# EAGLE design bebox_encoder (EAGLE 9.3.1)
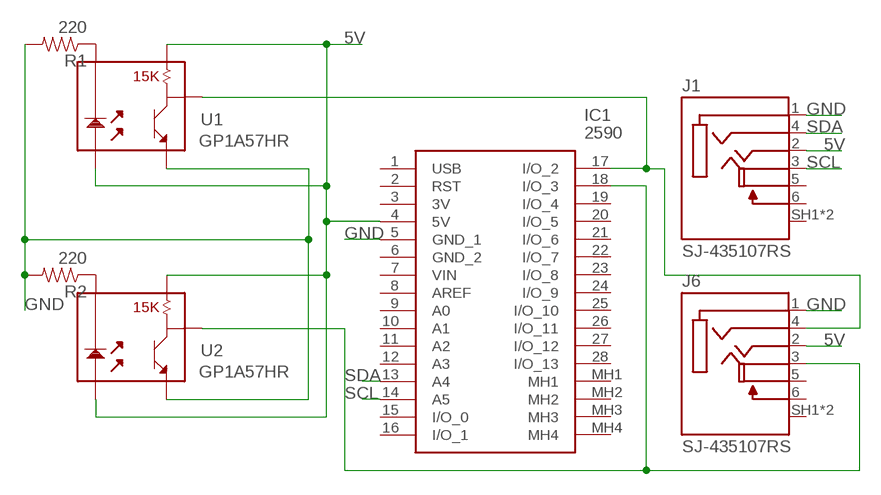
[diagram p0: schematic, sheet 1]

## Parts
IC1  2590  [2590]
J1  SJ-435107RS  [CUI_SJ-435107RS]
J6  SJ-435107RS  [CUI_SJ-435107RS]
R1  220  RESISTORPTH1  [AXIAL-0.3]
R2  220  RESISTORPTH1  [AXIAL-0.3]
U1  GP1A57HR  [GP1A57HR]
U2  GP1A57HR  [GP1A57HR]

## Nets
5V: IC1.4(5V) J1.2(TIP) J6.2(TIP) U1.1 U1.3 U2.1 U2.3
GND: IC1.5(GND_1) J1.1(SLEEVE) J6.1(SLEEVE) R1.P$2 R2.P$2 U1.5 U2.5
N$2: R2.P$1 U2.2
N$4: R1.P$1 U1.2
N$5: IC1.17(I/O_2) J6.4(RING2) U1.4
N$6: IC1.18(I/O_3) J6.3(RING1) U2.4
SCL: IC1.14(A5) J1.3(RING1)
SDA: IC1.13(A4) J1.4(RING2)
Unconnected: IC1.1(USB) IC1.2(RST) IC1.3(3V) IC1.6(GND_2) IC1.7(VIN) IC1.8(AREF) IC1.9(A0) IC1.10(A1) IC1.11(A2) IC1.12(A3) IC1.15(I/O_0) IC1.16(I/O_1) IC1.19(I/O_4) IC1.20(I/O_5) IC1.21(I/O_6) IC1.22(I/O_7) IC1.23(I/O_8) IC1.24(I/O_9) IC1.25(I/O_10) IC1.26(I/O_11) IC1.27(I/O_12) IC1.28(I/O_13) IC1.MH1 IC1.MH2 IC1.MH3 IC1.MH4 J1.5(ISOLATED_RING1) J1.6(ISOLATED_RING1_SWITCH(N-O)) J1.SH1(SHIELD) J1.SH2(SHIELD) J6.5(ISOLATED_RING1) J6.6(ISOLATED_RING1_SWITCH(N-O)) J6.SH1(SHIELD) J6.SH2(SHIELD)

## Library data of the parts
IC1 = 2590:2590: Development Boards & Kits - AVR Adafruit Metro Mini 328 - 5V 16MHz Source: Datasheet <https://www.adafruit.com/product/2590>; ALLIED_NUMBER: 70929194; ALLIED_PRICE-STOCK: https://www.alliedelec.com/adafruit-industries-2590/70929194/; DESCRIPTION: Development Boards & Kits - AVR Adafruit Metro Mini 328 - 5V 16MHz; HEIGHT: 4mm; MANUFACTURER_NAME: Adafruit; MANUFACTURER_PART_NUMBER: 2590; MOUSER_PART_NUMBER: 485-2590; MOUSER_PRICE-STOCK: https://www.mouser.com/Search/Refine.aspx?Keyword=485-2590; RS_PART_NUMBER: 1245512; RS_PRICE-STOCK: http://uk.rs-online.com/web/p/products/1245512
J1 J6 = SJ-435107RS:SJ-435107RS: 3.5 mm Right Angle Shielded (0.141", 1/8", Mini Plug) Female HeadPhone Jack; AVAILABILITY: Good; DESCRIPTION: 3.5 mm Right Angle Shielded _0.141, 1/8, Mini Plug_ Female HeadPhone Jack; MF: CUI; MP: SJ-435107RS; PACKAGE: None; PRICE: 1.04 USD
R1 R2 = SparkFun:RESISTOR: Resistor Basic schematic elements and footprints for 0603, 1206, and PTH 1/10th watt (small) resistors.
U1 U2 = SparkFun:GP1A57HR

## Board
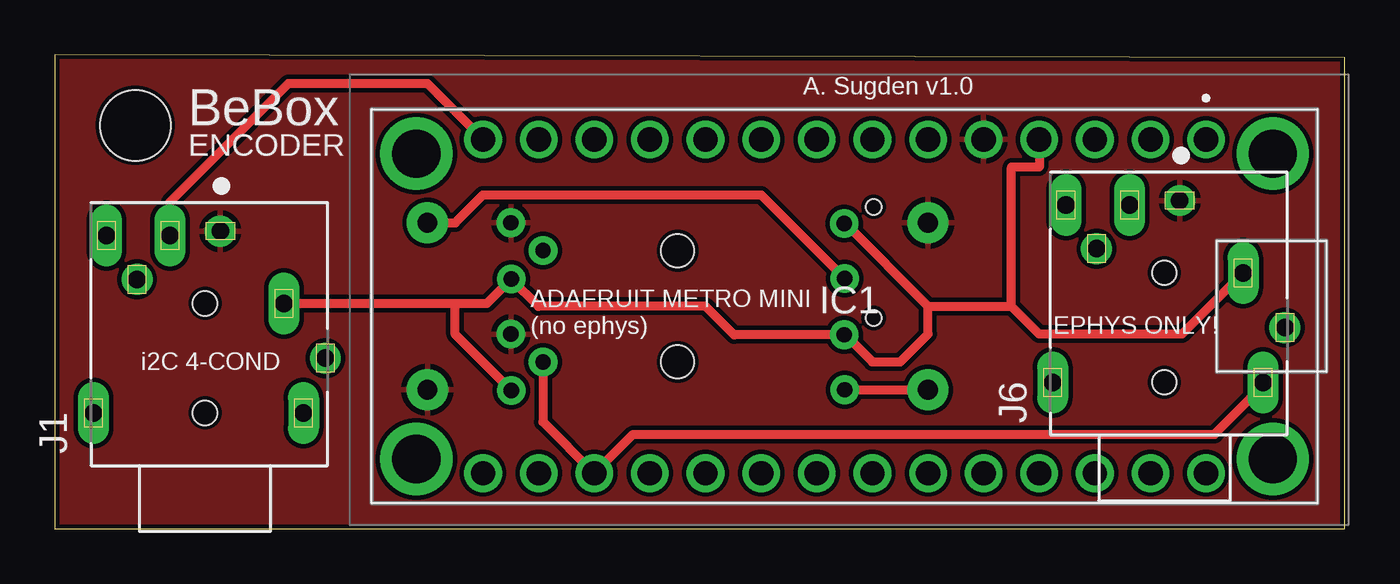
[diagram p1: board, top side]
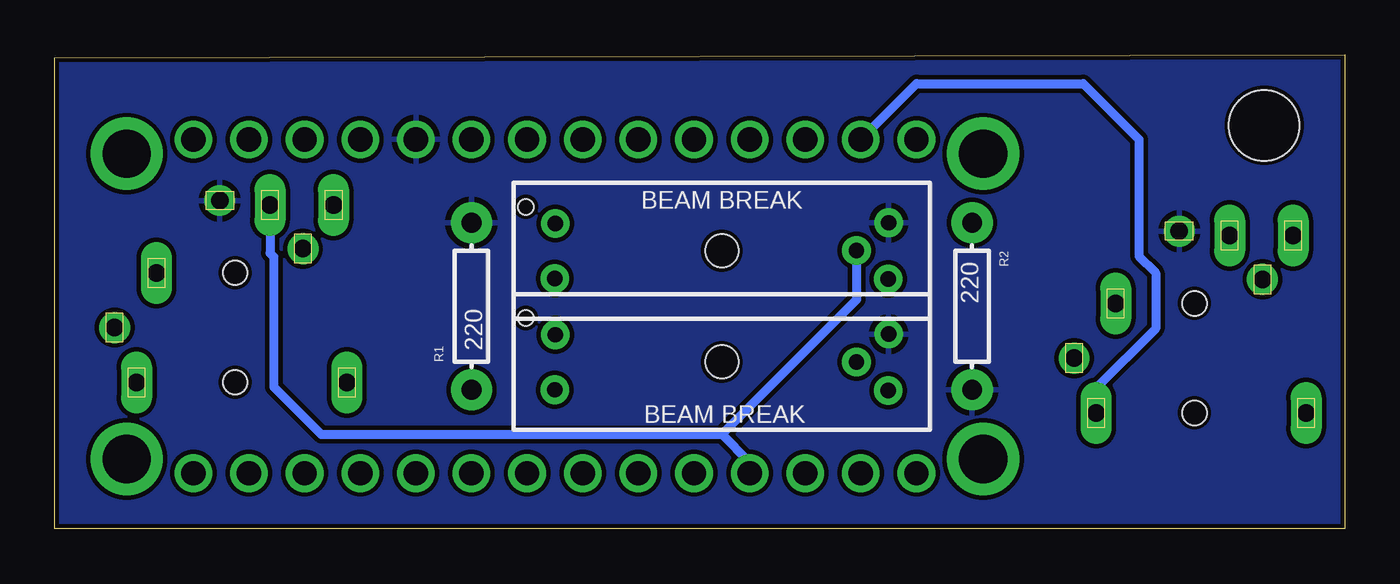
[diagram p2: board, bottom side, seen from below]

Size 58.91 x 21.64 mm. Coordinates in mm from the lower left corner, seen from the top.
Outline: 0,0 58.91,0 58.91,21.51 0,21.64 0,0
Copper layers (1*16): Top 0.035mm / dielectric 1.5mm / Bottom 0.035mm
Design rules "SparkFun": minimum track width 8mil, minimum drill 20mil, track to track 8mil, track to pad 8mil, pad to pad 8mil, via to via 8mil, smd to smd 8mil, copper to edge 8mil, drill to drill 8mil, minimum pad ring 12mil, minimum via ring 10mil, stop-mask expansion 4mil, vias tented up to drill 20mil, thermal gap 10mil
Holes 3.2 mm at 3.68,18.41

### Footprints (pad centres in the part's own frame; a part is rotated, then mirrored left to right if it is on the bottom)
2590 = drill 1.11 pad 1.665: 1 -16.51,-7.62; 2 -13.97,-7.62; 3 -11.43,-7.62; 4 -8.89,-7.62; 5 -6.35,-7.62; 6 -3.81,-7.62; 7 -1.27,-7.62; 8 1.27,-7.62; 9 3.81,-7.62; 10 6.35,-7.62; 11 8.89,-7.62; 12 11.43,-7.62; 13 13.97,-7.62; 14 16.51,-7.62; 15 16.51,7.62; 16 13.97,7.62; 17 11.43,7.62; 18 8.89,7.62; 19 6.35,7.62; 20 3.81,7.62; 21 1.27,7.62; 22 -1.27,7.62; 23 -3.81,7.62; 24 -6.35,7.62; 25 -8.89,7.62; 26 -11.43,7.62; 27 -13.97,7.62; 28 -16.51,7.62 | drill 2.2 pad 3.3: MH1 -19.558,6.968; MH2 -19.558,-6.968; MH3 19.558,-6.968; MH4 19.558,6.968
CUI_SJ-435107RS = drill 0.8 pad 1.1: 1 4.7,-0.7; 5 2.5,3.1; SH2 -1.1,-5.5 | drill 0.8 pad 1.1 long: 2 1.4,-3.6; 3 4.5,1.6; 4 -3.6,-4.5; 6 4.5,4.5; SH1 -3.6,5.1 | hole 1.1: -3.6,0; 1.4,0
AXIAL-0.3 = drill 0.9 pad 1.88: P$1 -3.81,0; P$2 3.81,0
GP1A57HR = drill 0.7: 1 -7.6,1.24; 2 -7.62,-1.27; 3 7.6,-1.3; 4 6.15,0; 5 7.62,1.27 | hole 1.5: 0,0 | hole 0.7: -8.95,2

### Placement (x,y rotation side)
IC1  36.07,10.16 180 top
J1  6.86,8.89 90 top
J6  50.67,10.29 90 top
R1  39.88,10.16 90 bottom
R2  17.02,10.16 270 bottom
U1  28.45,7.62 0 bottom
U2  28.45,12.7 0 bottom

### Tracks (layer width: path | path; a pad name or v marks a point on that pad's centre or on a via)
5V
  Top 0.406: IC1.4 44.96,16.51 43.69,16.51 43.69,10.16 | J6.2 51.48,8.89 44.96,8.89 43.69,10.16 | J1.2 18.29,10.29 | 18.29,10.29 19.74,10.29 U2.3 22.09,10.16 29.72,10.16 31.02,8.86 U1.1 36.1,8.86 37.34,7.62 38.61,7.62 39.88,8.89 39.88,10.16 | U1.3 18.29,8.88 18.29,10.29 | 39.88,10.16 43.69,10.16 | U2.1 36.1,13.94 39.88,10.16
GND
  pour Top: -0.76,21.59 -0.76,0 58.93,0 58.93,21.59
  pour Bottom: -0.76,21.59 -0.76,0 58.93,0 58.93,21.59
N$2
  Top 0.406: R2.P$1 18.29,13.97 19.56,15.24 32.26,15.24 U2.2
N$4
  Top 0.406: U1.2 R1.P$1
N$5
  Top 0.406: U1.4 22.3,4.88 IC1.17 26.42,4.32 52.96,4.32 55.17,6.53 J6.4
N$6
  Bottom 0.406: J6.3 49.07,12.59 48.9,12.42 48.9,6.49 46.74,4.32 28.45,4.32 | 28.45,4.32 27.18,3.05 IC1.18 | U2.4 22.3,10.47 28.45,4.32
SCL
  Top 0.406: IC1.14 17.02,20.32 10.67,20.32 5.26,14.91 J1.3
SDA
  Bottom 0.406: IC1.13 19.56,20.32 11.94,20.32 9.4,17.78 9.4,12.45 8.64,11.68 8.64,9.14 11.36,6.42 J1.4

### Text on the board
tPlace: A. Sugden v1.0 | BeBox | ENCODER | ADAFRUIT METRO MINI / (no ephys) | EPHYS ONLY! | i2C 4-COND
bPlace: BEAM BREAK | BEAM BREAK